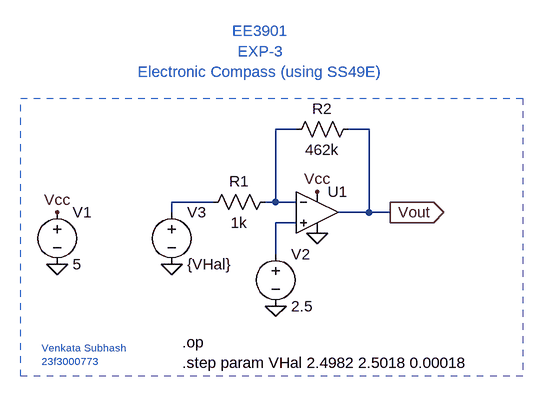
[diagram p0: schematic Hall-effect_sensor.asc]
Hall-effect_sensor.asc, the LTspice schematic file:
Version 4
SHEET 1 880 680
WIRE 432 160 400 160
WIRE 544 160 512 160
WIRE 304 272 240 272
WIRE 400 272 400 160
WIRE 400 272 384 272
WIRE 432 272 400 272
WIRE 240 288 240 272
WIRE 544 288 544 160
WIRE 544 288 496 288
WIRE 576 288 544 288
WIRE 432 304 400 304
WIRE 400 352 400 304
FLAG 64 368 0
FLAG 464 320 0
FLAG 64 288 Vcc
FLAG 464 256 Vcc
FLAG 400 432 0
FLAG 240 368 0
FLAG 576 288 Vout
IOPIN 576 288 Out
SYMBOL UniversalOpAmp 464 288 R0
SYMATTR InstName U1
SYMBOL Voltage 64 272 R0
SYMATTR InstName V1
SYMATTR Value 5
SYMBOL Res 400 256 R90
WINDOW 0 0 56 VBottom 2
WINDOW 3 32 56 VTop 2
SYMATTR InstName R1
SYMATTR Value 1k
SYMBOL Res 528 144 R90
WINDOW 0 0 56 VBottom 2
WINDOW 3 32 56 VTop 2
SYMATTR InstName R2
SYMATTR Value 462k
SYMBOL Voltage 400 336 R0
SYMATTR InstName V2
SYMATTR Value 2.5
SYMBOL Voltage 240 272 R0
SYMATTR InstName V3
SYMATTR Value {VHal}
TEXT 256 488 Left 2 !.op\n.step param VHal 2.4982 2.5018 0.00018
TEXT 40 496 Left 1 ;Venkata Subhash\n23f3000773
TEXT 376 40 Center 2 ;EE3901\nEXP-3\nElectronic Compass (using SS49E)
RECTANGLE Normal 8 112 780 540 2

The netlist it stands for:
* Hall-effect_sensor.asc
XU1 N003 N001 Vcc 0 Vout level1 Avol=1Meg GBW=10Meg Vos=0 En=0 Enk=0 In=0 Ink=0 Rin=500Meg  ; pins In+ In- V+ V- OUT
V1 Vcc 0 5
R1 N001 N002 1k
R2 Vout N001 462k
V2 N003 0 2.5
V3 N002 0 {VHal}
.op
.step param VHal 2.4982 2.5018 0.00018
* Venkata Subhash
* 23f3000773
* EE3901
* EXP-3
* Electronic Compass (using SS49E)
.lib UniversalOpAmp1.lib
.backanno
.end